# EAGLE schematic RoverEncoder (EAGLE 6.4)
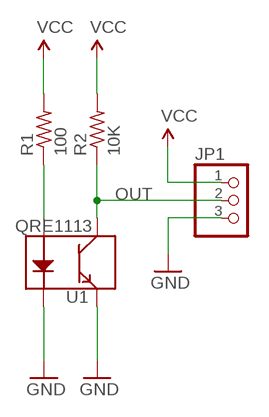
[diagram p0: schematic, sheet 1]

## Parts
JP1  PINHD-1X03_2.54-S  [1X03-S]
R1  100  R-US_R0603  [R0603]
R2  10K  R-US_R0603  [R0603]
U1  QRE1113  [QRE1113]

## Nets
GND: JP1.3 U1.2(K) U1.4(E)
N$1: R1.1 U1.1(A)
OUT: JP1.2 R2.1 U1.3(C)
VCC: JP1.1 R1.2 R2.2

## Library data of the parts
JP1 = pinhead-2:PINHD-1X03: PIN HEADER
R1 R2 = rcl:R-US_: RESISTOR, American symbol
U1 = SparkFun:QRE1113